# Altium schematic sheet Arduino Board.SchDoc
size A4
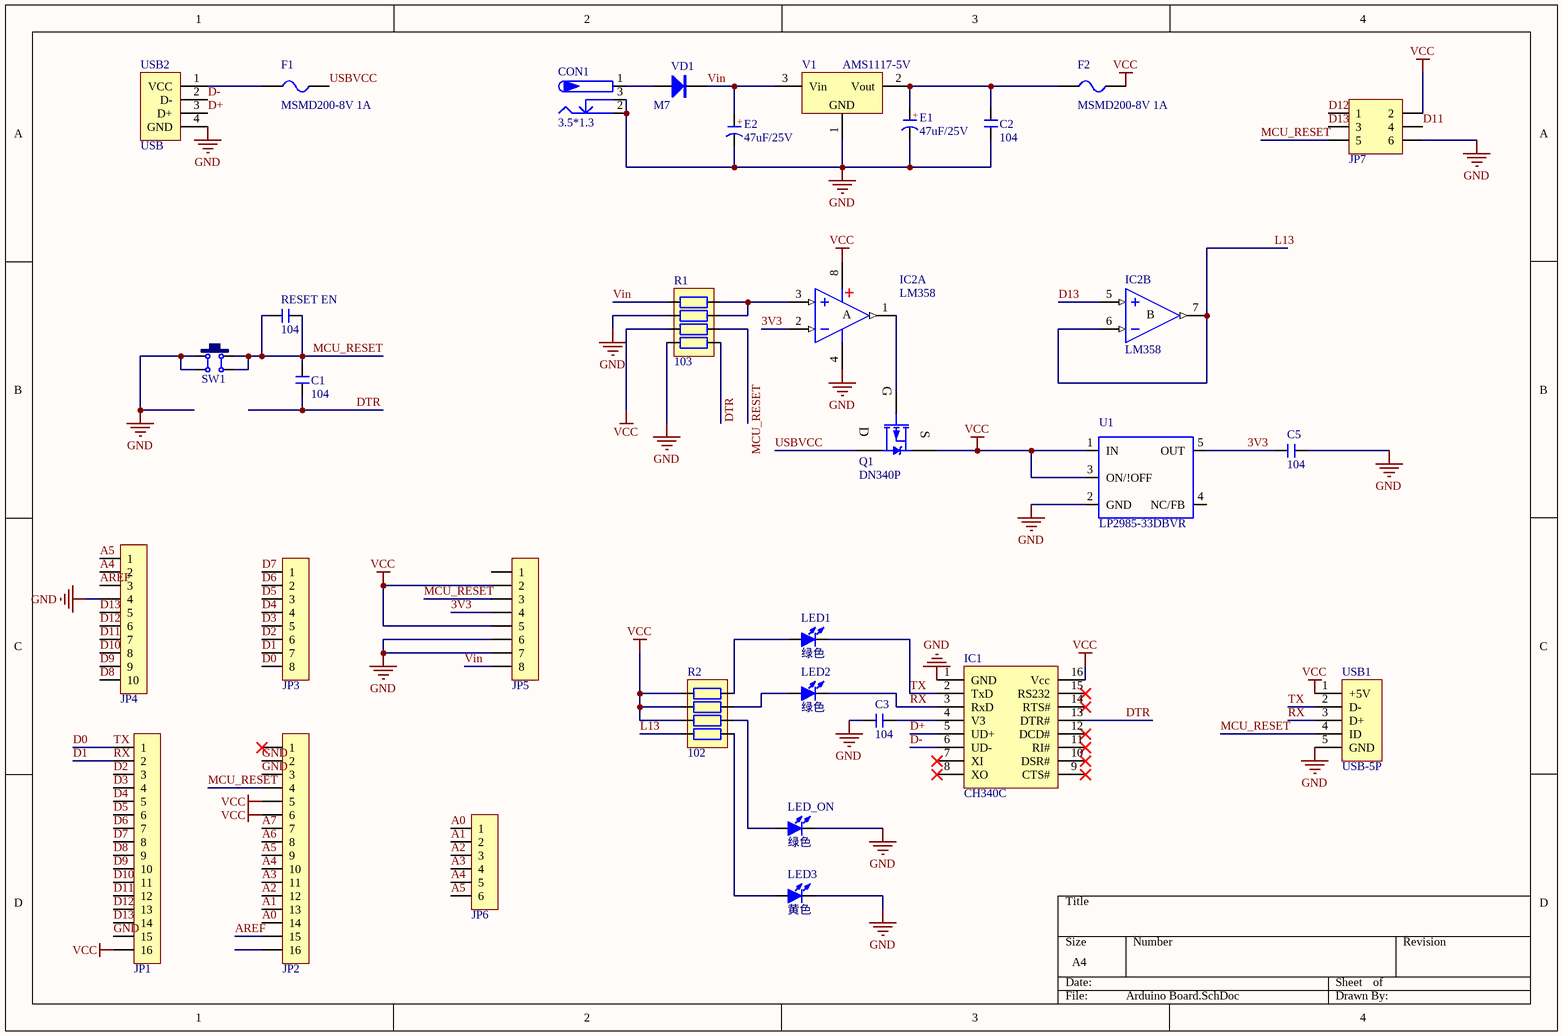
[diagram p0: Arduino Board.SchDoc]

## Parts
C1  104  [C 0603]
C2  104  [C 0603]
C3  104  [C 0603]
C5  104  [C 0603]
CON1  3.5*1.3  [DC-005]
E1  47uF/25V  [CM D(6.3*5.4)]
E2  47uF/25V  [CM D(6.3*5.4)]
F1  MSMD200-8V 1A  [FU 1812]
F2  MSMD200-8V 1A  [FU 1812]
IC1  CH340C  [SOP16_L]
IC2  LM358  [MSOP8_L]  (parts A,B of 2)
JP1  HDR-1X16  [HDR-1X16_M]  (value not drawn)
JP2  HDR-1X16  [HDR-1X16_M]  (value not drawn)
JP3  HDR-1X8  [HDR-1X8_M]  (value not drawn)
JP4  HDR-1X10  [HDR-1X10_M]  (value not drawn)
JP5  HDR-1X8  [HDR-1X8_M]  (value not drawn)
JP6  HDR-1X6  [HDR-1X6_M]  (value not drawn)
JP7  Header3X2  [HDR-3X2]  (value not drawn)
LED1  绿色  [LED 0603B]
LED2  绿色  [LED 0603B]
LED3  黄色  [LED 0603B]
LED_ON  绿色  [LED 0603B]
Q1  DN340P  [SOT23-3N]
R1  103  [RCA-8P4R-0603]
R2  102  [RCA-8P4R-0603]
RESET_EN  104  [C 0603]
SW1  6x6x5  [TSW SMD-6*6*4.3]  (value not drawn)
U1  LP2985-33DBVR  [SOT23-5L]
USB1  USB-5P  [USB-MICRO_D]
USB2  USB  [USB-B/S_A]
V1  AMS1117-5V  [SOT223_N]
VD1  M7  [SMA]

## Nets
GND: C2.1 C3.1 C5.2 CON1.2 CON1.3 E1.2(K) E2.2(K) IC1.1(GND) IC2.4(V-) JP1.15 JP2.2 JP2.3 JP4.4 JP5.6 JP5.7 JP7.6 LED3.2(K) LED_ON.2(K) R1.2 R1.4 SW1.1 SW1.4 U1.2(GND) USB1.5(GND) USB2.4(GND) V1.1(GND)
VCC: F2.2 IC1.16(Vcc) IC2.8(V+) JP1.16 JP2.5 JP2.6 JP5.2 JP5.5 JP7.2 Q1.2(S) R1.3 R2.1 R2.2 R2.3 U1.1(IN) U1.3(ON/!OFF) USB1.1(+5V)
3V3: C5.1 IC2.2(IN-) JP5.4 U1.5(OUT)
A0: JP2.14 JP6.1
A1: JP2.13 JP6.2
A2: JP2.12 JP6.3
A3: JP2.11 JP6.4
A4: JP2.10 JP4.2 JP6.5
A5: JP2.9 JP4.1 JP6.6
A6: JP2.8
A7: JP2.7
AREF: JP2.15 JP4.3
D0: IC1.2(TxD) JP1.1 JP3.8 LED1.2(K) USB1.2(D-)  [also labelled TX]
D1: IC1.3(RxD) JP1.2 JP3.7 LED2.2(K) USB1.3(D+)  [also labelled RX]
D2: JP1.3 JP3.6
D3: JP1.4 JP3.5
D4: JP1.5 JP3.4
D5: JP1.6 JP3.3
D6: JP1.7 JP3.2
D7: JP1.8 JP3.1
D8: JP1.9 JP4.10
D9: JP1.10 JP4.9
D10: JP1.11 JP4.8
D11: JP1.12 JP4.7 JP7.4
D12: JP1.13 JP4.6 JP7.1
D13: IC2.5(IN+) JP1.14 JP4.5 JP7.3
D+: IC1.5(UD+) USB2.3(D+)
D-: IC1.6(UD-) USB2.2(D-)
DTR: C1.1 IC1.13(DTR#) R1.5
L13: IC2.6(IN-) IC2.7(OUT) R2.4
MCU_RESET: C1.2 JP2.4 JP5.3 JP7.5 R1.6 RESET_EN.1 RESET_EN.2 SW1.2 SW1.3 USB1.4(ID)
USBVCC: F1.2 Q1.3(D)
Vin: E2.1(A) JP5.8 R1.1 V1.3(Vin) VD1.2(K)
NetC2_2: C2.2 E1.1(A) F2.1 V1.2(Vout)
NetC3_2: C3.2 IC1.4(V3)
NetCON1_1: CON1.1 VD1.1(A)
NetF1_1: F1.1 USB2.1(VCC)
NetIC2_1: IC2.1(OUT) Q1.1(G)
NetIC2_3: IC2.3(IN+) R1.7 R1.8
NetLED1_1: LED1.1(A) R2.8
NetLED2_1: LED2.1(A) R2.7
NetLED3_1: LED3.1(A) R2.5
NetLED_ON_1: LED_ON.1(A) R2.6

Not connected (* = marked no-connect by the designer): IC1 7(XI)* 8(XO)* 9(CTS#)* 10(DSR#)* 11(RI#)* 12(DCD#)* 14(RTS#)* 15(RS232)*; JP2 1* 16; JP5 1; U1 4(NC/FB)

## Notes on the sheet
- (in symbol C-CM) +
- (in symbol LM358, part A) A
- (in symbol LM358, part B) B

## Library data of the parts
C1-C3 C5 RESET_EN = C: 无极性贴片电容; 版权归属: 源创客; BOM名称: 无极性贴片电容; 学习资源: www.ooocke.com
CON1 = P-DC: 低压电源接口; BOM名称: DC电源接口; 版权归属: 源创客; 学习资源: www.ooocke.com
E1 E2 = C-CM: 贴片电解电容; 版权归属: 源创客; BOM名称: 贴片电解电容; 学习资源: www.ooocke.com
F1 F2 = FU: 贴片保险丝; 版权归属: 源创客; BOM名称: 贴片保险丝; 学习资源: www.ooocke.com
IC1 = CH340G: 串口转USB; 版权归属: 源创客; BOM名称: 串口转USB; 学习资源: www.ooocke.com
IC2 = LM358: 双路运放; 版权归属: 源创客; BOM名称: 双路运放; 学习资源: www.ooocke.com
JP1 JP2 = Header 16: 16P接插件; 版权归属: 源创客; BOM名称: 16P接插件; 学习资源: www.ooocke.com
JP3 JP5 = Header 8: 8P接插件; 版权归属: 源创客; BOM名称: 8P接插件; 学习资源: www.ooocke.com
JP4 = Header 10: 10P接插件; 版权归属: 源创客; BOM名称: 10P接插件; 学习资源: www.ooocke.com
JP6 = Header 6: 6P接插件; 版权归属: 源创客; BOM名称: 6P接插件; 学习资源: www.ooocke.com
JP7 = Header 3X2: 3*2P接插件; 版权归属: 源创客; BOM名称: 3*2P接插件; 学习资源: www.ooocke.com
LED1-LED3 LED_ON = LED-SMD: 贴片LED; 版权归属: 源创客; BOM名称: 贴片LED; 学习资源: www.ooocke.com
Q1 = SI2301: P沟道场效应管; 版权归属: 源创客; BOM名称: P沟道场效应管; 学习资源: www.ooocke.com
R1 R2 = R-8P4R: 贴片网络排阻; 版权归属: 源创客; BOM名称: 贴片网络排阻; 学习资源: www.ooocke.com
SW1 = TSW SMD-6x6: 贴片6x6轻触开关; 版权归属: 源创客; BOM名称: 贴片6x6轻触开关; 学习资源: www.ooocke.com
U1 = LP2985-XXDBVR33
USB1 = USB-5P: 微型USB母座; 版权归属: 源创客; BOM名称: 微型USB母座; 学习资源: www.ooocke.com
USB2 = USB-B/S: USB-B型母接口; 版权归属: 源创客; BOM名称: USB-B型母接口; 学习资源: www.ooocke.com
V1 = AMS1117: 三端稳压芯片; BOM名称: 稳压芯片; 版权归属: 源创客; 学习资源: www.ooocke.com
VD1 = M7: 整流二极管; 版权归属: 源创客; BOM名称: 整流二极管; 学习资源: www.ooocke.com